# Altium schematic sheet 23_PCIe.SchDoc: PCI Express x4
size A4; Organization: Lime Microsystems; Address1: Surrey Tech Centre; Address2: Guildford GU2 7YG; Address3: Surrey; Address4: United Kingdom; Revision: v1.2; SheetNumber: 21; SheetTotal: 27
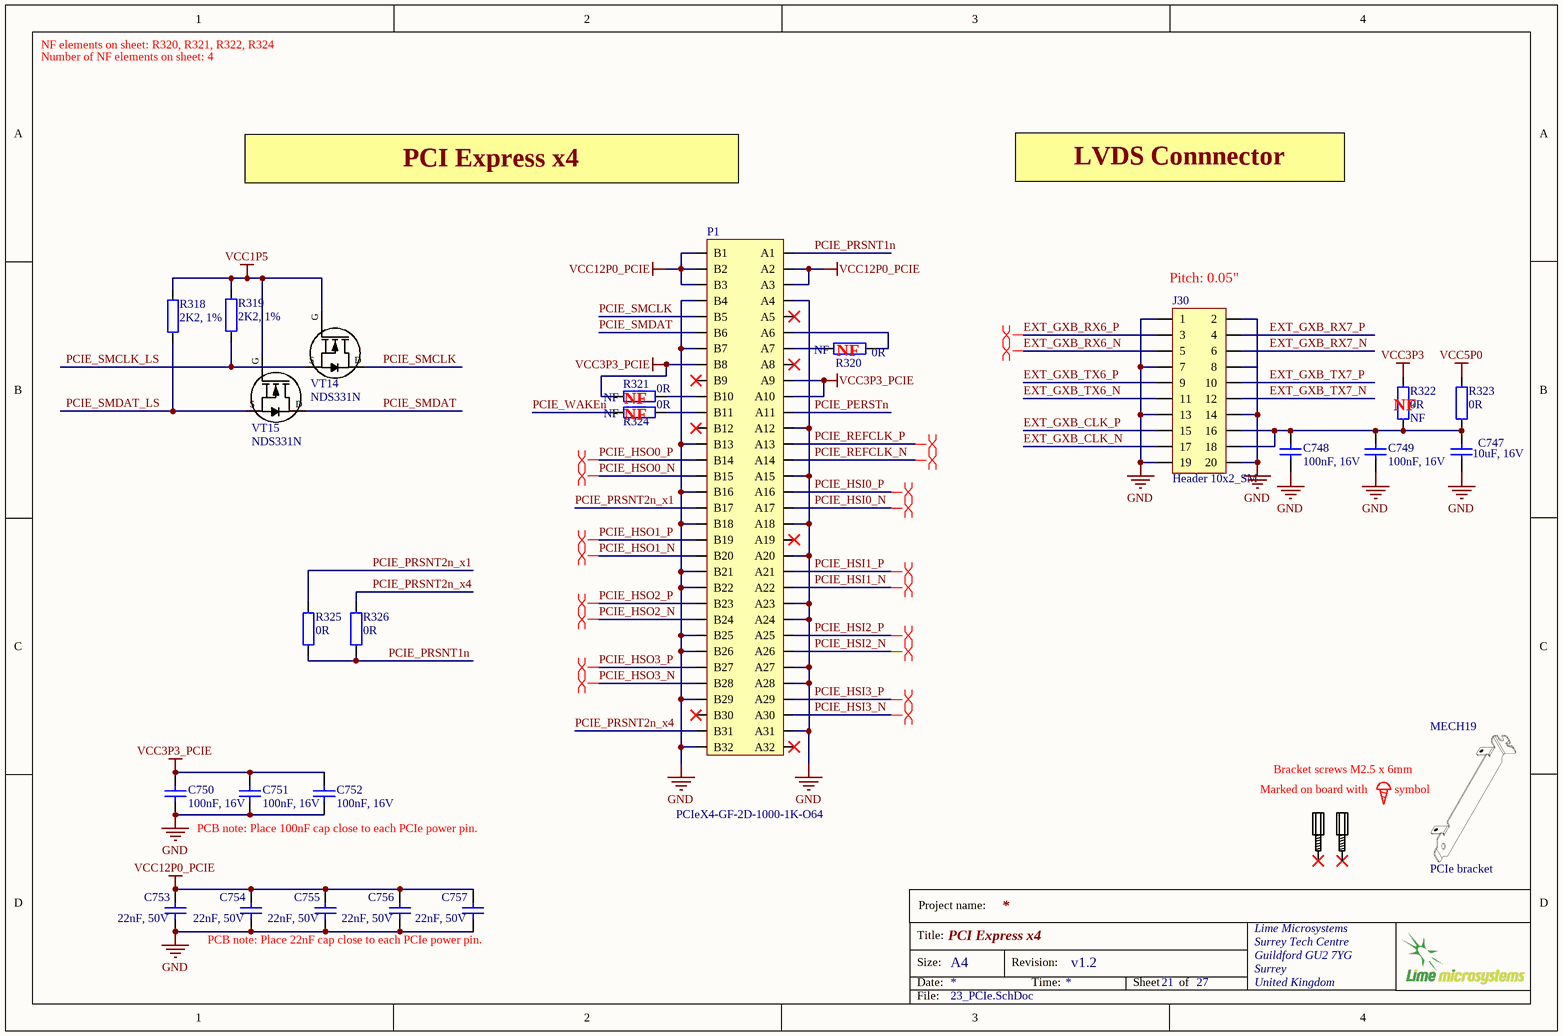
[diagram p0: 23_PCIe.SchDoc]

## Parts
C747  10uF, 16V  [CAP0603]
C748  100nF, 16V  [CAP0402]
C749  100nF, 16V  [CAP0402]
C750  100nF, 16V  [CAP0402]
C751  100nF, 16V  [CAP0402]
C752  100nF, 16V  [CAP0402]
C753  22nF, 50V  [CAP0402]
C754  22nF, 50V  [CAP0402]
C755  22nF, 50V  [CAP0402]
C756  22nF, 50V  [CAP0402]
C757  22nF, 50V  [CAP0402]
J30  Header 10x2_SM  [HEADER_10x2_SM_HALF_PITCH]
MECH19  PCIe bracket  [PCIe_bracket]
MECH20  Spacer M3  [PCIe_bracket_screw_M2.5]  (value not drawn)
MECH21  Spacer M3  [PCIe_bracket_screw_M2.5]  (value not drawn)
P1  PCIeX4-GF-2D-1000-1K-O64  [PCIeX4-GF-2D-1000-1K-O64]  (no BOM)
R318  2K2, 1%  [RES0402]
R319  2K2, 1%  [RES0402]
R320  0R  Assembly Info: NF  [RES0402]
R321  0R  Assembly Info: NF  [RES0402]
R322  0R  Assembly Info: NF  [RES0402]
R323  0R  [RES0402]
R324  0R  Assembly Info: NF  [RES0402]
R325  0R  [RES0402]
R326  0R  [RES0402]
VT14  NDS331N  [SOT23-3]
VT15  NDS331N  [SOT23-3]

## Nets
GND: C747.1 C748.2 C749.2 C750.2 C751.2 C752.2 C753.2 C754.2 C755.2 C756.2 C757.2 J30.1 J30.2 J30.7 J30.8 J30.13 J30.14 J30.19 J30.20 P1.A4 P1.A12 P1.A15 P1.A18 P1.A20 P1.A23 P1.A24 P1.A27 P1.A28 P1.A31 P1.B4 P1.B7 P1.B13 P1.B16 P1.B18 P1.B21 P1.B22 P1.B25 P1.B26 P1.B29 P1.B32
VCC1P5: R318.1 R319.1 VT14.G VT15.G
VCC3P3: R322.1
VCC3P3_PCIE: C750.1 C751.1 C752.1 P1.A9 P1.A10 P1.B8 R321.1
VCC5P0: R323.1
VCC12P0_PCIE: C753.1 C754.1 C755.1 C756.1 C757.1 P1.A2 P1.A3 P1.B1 P1.B2 P1.B3
EXT_GXB_CLK_N: J30.17
EXT_GXB_CLK_P: J30.15
EXT_GXB_RX6_N: J30.5
EXT_GXB_RX6_P: J30.3
EXT_GXB_RX7_N: J30.6
EXT_GXB_RX7_P: J30.4
EXT_GXB_TX6_N: J30.11
EXT_GXB_TX6_P: J30.9
EXT_GXB_TX7_N: J30.12
EXT_GXB_TX7_P: J30.10
PCIE_HSI0_N: P1.A17
PCIE_HSI0_P: P1.A16
PCIE_HSI1_N: P1.A22
PCIE_HSI1_P: P1.A21
PCIE_HSI2_N: P1.A26
PCIE_HSI2_P: P1.A25
PCIE_HSI3_N: P1.A30
PCIE_HSI3_P: P1.A29
PCIE_HSO0_N: P1.B15
PCIE_HSO0_P: P1.B14
PCIE_HSO1_N: P1.B20
PCIE_HSO1_P: P1.B19
PCIE_HSO2_N: P1.B24
PCIE_HSO2_P: P1.B23
PCIE_HSO3_N: P1.B28
PCIE_HSO3_P: P1.B27
PCIE_PERSTn: P1.A11
PCIE_PRSNT1n: P1.A1 R325.1 R326.1
PCIE_PRSNT2n_x1: P1.B17 R325.2
PCIE_PRSNT2n_x4: P1.B31 R326.2
PCIE_REFCLK_N: P1.A14
PCIE_REFCLK_P: P1.A13
PCIE_SMCLK: P1.B5 VT14.D
PCIE_SMCLK_LS: R319.2 VT14.S
PCIE_SMDAT: P1.B6 VT15.D
PCIE_SMDAT_LS: R318.2 VT15.S
PCIE_WAKEn: R324.1
NetC747_2: C747.2 C748.1 C749.1 J30.16 J30.18 R322.2 R323.2
NetP1_A6: P1.A6 R320.2
NetP1_A7: P1.A7 R320.1
NetP1_B10: P1.B10 R321.2
NetP1_B11: P1.B11 R324.2

Not connected (* = marked no-connect by the designer): MECH20 MH1*; MECH21 MH1*; P1 A5* A8* A19* A32* B9* B12* B30*

## Layout directives
differential pair: EXT_GXB_RX6_N, EXT_GXB_RX6_P, PCIE_HSI0_N, PCIE_HSI0_P, PCIE_HSI1_N, PCIE_HSI1_P, PCIE_HSI2_N, PCIE_HSI2_P, PCIE_HSI3_N, PCIE_HSI3_P, PCIE_HSO0_N, PCIE_HSO0_P, PCIE_HSO1_N, PCIE_HSO1_P, PCIE_HSO2_N, PCIE_HSO2_P, PCIE_HSO3_N, PCIE_HSO3_P, PCIE_REFCLK_N, PCIE_REFCLK_P

## Notes on the sheet
- NF elements on sheet: R320, R321, R322, R324
- Number of NF elements on sheet: 4
- PCI Express x4
- LVDS Connnector
- (near J30) Pitch: 0.05"
- (near R320) NF
- (near R324) NF
- (near R321) NF
- (near R322) NF
- (near MECH19) Bracket screws M2.5 x 6mm
- PCB note: Place 100nF cap close to each PCIe power pin.
- Marked on board with         symbol
- PCB note: Place 22nF cap close to each PCIe power pin.
- Project name:
- Title:
- Size:
- Date:
- A4
- Revision:
- Time:
- Sheet
- of
- File:

## Library data of the parts
C747 = Cap_0603: Manufacturer: Yageo; Manufacturer Part Number 1: GRM188R61C106MA73D; Part Description: 10µF ±20% 16V Ceramic Capacitor X5R 0603 (1608 Metric); Temperature Coefficient: X5R; Capacitance: 10µF; Tolerance: ±20%; Value: 10uF, 16V; Supplier 1: Digi-Key; Supplier Part Number 1: 490-7201-2-ND; Category: Capacitors; Ratings: -; Features: -; Lead Style: -; Package / Case: 0603 (1608 Metric); Lead Spacing: -; Applications: General Purpose; Voltage - Rated: 16V; Operating Temperature: -55°C ~ 85°C; Thickness (Max): 0.039" (1.00mm); Mounting Type: Surface Mount, MLCC; RoHS: RoHS Compliant; Size / Dimension: 0.063" L x 0.031" W (1.60mm x 0.80mm); Packaging: Tape & Reel (TR); Height - Seated (Max): -
C748 C749 = Cap_0603: Manufacturer Part Number 1: GRM155R71C104KA88D; Part Description: 0.10µF ±10% 16V Ceramic Capacitor X7R 0402 (1005 Metric); Brand: Murata Electronics; Tolerance: 10 %; Type: General Purpose MLCC; Capacitance: 0.1 uF; Temperature Coefficient / Code: +/- 15 %; Case Height: 0.5 mm; Case Length: 1 mm; Dielectric: X7R; Supplier 1: Mouser; Supplier Part Number 1: 81-GRM155R71C104KA88; Case Code - in: 0402; Manufacturer: Murata Electronics; Category: Multilayer Ceramic Capacitors MLCC - SMD/SMT; Voltage Rating DC: 16 V; Value: 100nF, 16V; Manufacturer Part Number: GRM155R71C104KA88D; Case Code - mm: 1005; Case Width: 0.5 mm; Maximum Operating Temperature: + 125 C; Minimum Operating Temperature: - 55 C; Minimum Order Quantity: 1; Operating Temperature Range: - 55 C to + 125 C; Package / Case: 0402 (1005 metric); Packaging: Reel; Product: General Type MLCCs; Product Category: Low & Medium Capacitance SMD Ceramic Chip Capacitors; Reeling: True; RoHS - Mouser: Y; RoHS: RoHS Compliant; Series: GRM; Standard Pack Qty: 10000; Termination Style: SMD/SMT
C750-C752 = Cap_0603: Part Description: 0.10µF ±10% 16V Ceramic Capacitor X7R 0402 (1005 Metric); Manufacturer Part Number 1: GRM155R71C104KA88D; Brand: Murata Electronics; Tolerance: 10 %; Type: General Purpose MLCC; Capacitance: 0.1 uF; Temperature Coefficient / Code: +/- 15 %; Case Height: 0.5 mm; Case Length: 1 mm; Dielectric: X7R; Supplier 1: Mouser; Supplier Part Number 1: 81-GRM155R71C104KA88; Case Code - in: 0402; Manufacturer: Murata Electronics; Category: Multilayer Ceramic Capacitors MLCC - SMD/SMT; Voltage Rating DC: 16 V; Value: 100nF, 16V; Case Code - mm: 1005; Case Width: 0.5 mm; Manufacturer Part Number: GRM155R71C104KA88D; Maximum Operating Temperature: + 125 C; Minimum Operating Temperature: - 55 C; Minimum Order Quantity: 1; Operating Temperature Range: - 55 C to + 125 C; Package / Case: 0402 (1005 metric); Packaging: Reel; Product: General Type MLCCs; Product Category: Low & Medium Capacitance SMD Ceramic Chip Capacitors; Reeling: True; RoHS - Mouser: Y; RoHS: RoHS Compliant; Series: GRM; Standard Pack Qty: 10000; Termination Style: SMD/SMT
C753-C757 = Cap_0402: Manufacturer: Kemet; Manufacturer Part Number 1: C0402C223K5RACTU; Part Description: 0.022µF ±10% 50V Ceramic Capacitor X7R 0402 (1005 Metric); Temperature Coefficient: X7R; Tolerance: ±10%; Capacitance: 0.022µF; Value: 22nF, 50V; Supplier 1: Digi-Key; Supplier Part Number 1: 399-7780-1-ND; Ratings: -; Packaging: Cut Tape (CT); Category: Capacitors; Size / Dimension: 0.039" L x 0.020" W (1.00mm x 0.50mm); RoHS: RoHS Compliant; Operating Temperature: -55°C ~ 125°C; Mounting Type: Surface Mount, MLCC; Applications: General Purpose; Voltage - Rated: 50V; Thickness (Max): 0.022" (0.55mm); Features: -; Height - Seated (Max): -; Lead Style: -; Package / Case: 0402 (1005 Metric); Lead Spacing: -
J30 = Header 10x2_SM: Manufacturer: Amphenol FCI; Manufacturer Part Number 1: 20021121-00020C4LF; Part Description: 20 Positions Header Connector 0.050" (1.27mm) Surface Mount Gold; Pitch - Mating: 0.050" (1.27mm); Style: Board to Board; Shrouding: Unshrouded; Number of Positions: 20; Number of Positions Loaded: All; Contact Length - Mating: 0.120" (3.05mm); Material Flammability Rating: UL94 V-0; Supplier 1: Digi-Key; RoHS: RoHS Compliant; Category: Connectors, Interconnects; Stock 1: 7468; Pricing 1: 1=1.49, 10=1.351, 100=1.1582 (USD); Packaging: Cut Tape (CT); Part Status: Active; Connector Type: Header; Contact Type: Male Pin; Number of Rows: 2; Row Spacing - Mating: 0.050" (1.27mm); Mounting Type: Surface Mount; Termination: Solder; Fastening Type: Push-Pull; Contact Length - Post: -; Overall Contact Length: -; Insulation Height: -; Contact Shape: Square; Contact Finish - Mating: Gold; Contact Finish Thickness - Mating: 10µin (0.25µm); Contact Finish - Post: Tin; Contact Material: Copper Alloy; Insulation Material: Thermoplastic; Features: Pick and Place; Operating Temperature: -; Ingress Protection: -; Insulation Color: Black; Current Rating: -; Voltage Rating: -; Mated Stacking Heights: -; Contact Finish Thickness - Post: 50µin (1.27µm); Applications: -; ComponentLink1URL: http://portal.fciconnect.com/Comergent//fci/drawing/20021121.pdf; ComponentLink1Description: http://portal.fciconnect.com/Comergent//fci/drawing/20021121.pdf; Supplier Part Number 1: 609-3698-1-ND
MECH19 = PCIe_bracket: Manufacturer: Keystone Electronics; Manufacturer Part Number 1: 9203; Part Description: BRACKET, COMPUTER, PCI,LENGTH 120mm, HOLE TO HOLE DISTANCE 85.4mm; Card Type: PCI; Style: Blank; Supplier 1: Digi-Key; RoHS: RoHS Compliant; Category: Computers, Office - Components, Accessories; Stock 1: 5093; Pricing 1: 1=3.31, 10=2.083, 50=1.87, 100=1.785, 250=1.615, 1000=1.44, 2500=1.28001, 5000=1.1305 (USD); Part Status: Active; Material: Steel, Nickel Plated; ComponentLink1URL: http://www.keyelco.com/product-pdf.cfm?p=2468; ComponentLink1Description: http://www.keyelco.com/product-pdf.cfm?p=2468; Supplier Part Number 1: 36-9203-ND
MECH20 MECH21 = STANDOFF_M-F_THREADED_M3x8x10mm_HEX_5mm dia: STANDOFF M/F MET 5MM HEX 10MM L; Part Description: The M2.56 PRA2MCS100- is a M2.5 x 6mm Machine Screw, made of 18/8 stainless steel (A2 grade) with self colour finish, cross-recessed pan head Pozidriv head style. Designed according to DIN 7985 standard. Corrosion resistant under normal atmospheric conditions.; Manufacturer: DURATOOL; Manufacturer Part Number 1: M2.56 PRA2MCS100-; Thread Size - Metric: M2.5; Fastener Material: Stainless Steel; Screw Length: 6; Screw Head Style: Pan Head Pozidriv; SVHC: No SVHC (12-Jan-2017); Driver Type: Pozi; Thread Size: M2.5<!--FANDB--><div class="features-and-benefits-container"><div class="features-and-benefits-description"><span class="features-benefits-value">The M2.56 PRA2MCS100- is a M2.5 x 6mm Machine Screw, made of 18/8 stainless steel (A2 grade) with self colour finish, cross-recessed pan head Pozidriv head style. Designed according to DIN 7985 standard. Corrosion resistant under normal atmospheric conditions.</span></div><div class="features-and-benefits-list"><ul class="features-and-benefits-list-list"><li class="features-and-benefits-list-item">5; Supplier 1: Farnell; Supplier Part Number 1: 1420030; RoHS: YES; Stock 1: 256; Pricing 1: 100=0.0542, 10000=0.0503, 25000=0.0477, 50000=0.0467 (GBP); Thread Size - Imperial: -; Fastener Plating: -; Product Range: -; External Length / Height: 6; Material: Stainless Steel; ComponentLink1URL: http://www.farnell.com/datasheets/1661804.pdf; ComponentLink1Description: http://www.farnell.com/datasheets/1661804.pdf
R318 R319 = Res_0402: Part Description: RES SMD 2.2K OHM 1% 1/16W 0402; Manufacturer Part Number 1: RMCF0402FT2K20; Resistance (Ohms): 2.2k; Temperature Coefficient: ±100ppm/°C; Supplier 1: Digi-Key; Supplier Part Number 1: RMCF0402FT2K20CT-ND; Height: 0.016" (0.40mm); Tolerance: ±1%; Composition: Thick Film; Package / Case: 0402 (1005 Metric); Category: Resistors; Value: 2K2, 1%
R320 R321 R324-R326 = Res_0402: Manufacturer: Yageo; Part Description: RES SMD 0.0OHM JUMPER 1/16W 0402; Manufacturer Part Number 1: RC0402JR-070RL; Supplier 1: Digi-Key; Supplier Part Number 1: 311-0.0JRTR-ND; Composition: Thick Film; Package / Case: 0402 (1005 Metric); Category: Resistors; Value: 0R
R322 R323 = Res_0402: Manufacturer Part Number 1: RC0402JR-070RL; Manufacturer: Yageo; Part Description: RES SMD 0.0OHM JUMPER 1/16W 0402; Resistance (Ohms): 0.0; Tolerance: Jumper; Power (Watts): 0.063W, 1/16W; Value: 0R; Supplier 1: Digi-Key; Supplier Part Number 1: 311-0.0JRTR-ND; Category: Resistors; Temperature Coefficient: -; Features: Moisture Resistant; Supplier Device Package: 0402; Height: 0.016" (0.40mm); Package / Case: 0402 (1005 Metric); Operating Temperature: -55°C ~ 155°C; Size / Dimension: 0.039" L x 0.020" W (1.00mm x 0.50mm); Composition: Thick Film; Packaging: Tape & Reel (TR); Number of Terminations: 2; RoHS: RoHS Compliant
VT14 VT15 = NDS331N: Part Description: MOSFET N-CH 20V 1.3A SSOT3; Manufacturer: Fairchild Semiconductor; Gate Charge (Qg) @ Vgs: 5nC @ 4.5V; Power - Max: 460mW; Current - Continuous Drain (Id) @ 25°C: 1.3A (Ta); Input Capacitance (Ciss) @ Vds: 162pF @ 10V; FET Type: MOSFET N-Channel, Metal Oxide; Drain to Source Voltage (Vdss): 20V; FET Feature: Logic Level Gate; Supplier Device Package: 3-SSOT; Category: Discrete Semiconductor Products; Mounting Type: Surface Mount; Package / Case: TO-236-3, SC-59, SOT-23-3; Supplier 1: Digi-Key; Supplier Part Number 1: NDS331NCT-ND; Manufacturer Part Number 1: NDS331N
  VT15: Manufacturer Part Number: NDS331N